# EAGLE design main (EAGLE 8.3.2)
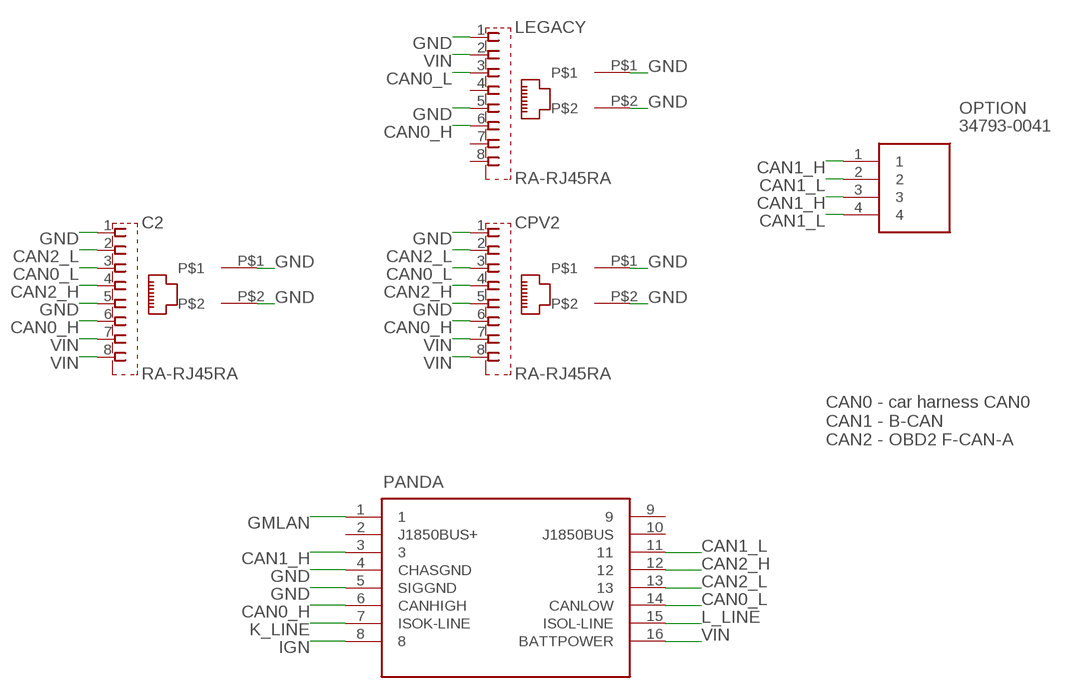
[diagram p0: schematic, sheet 1]

## Parts
C2  RA-RJ45RA  [RA-RJ45]
CPV2  RA-RJ45RA  [RA-RJ45]
LEGACY  RA-RJ45RA  [RA-RJ45]
OPTION  34793-0041  [347930041]
PANDA  OBDII-FEMALEFEMALE  [OBDII-FEMALE]

## Nets
CAN0_H: C2.6 CPV2.6 LEGACY.6 PANDA.6(CANHIGH)
CAN0_L: C2.3 CPV2.3 LEGACY.3 PANDA.14(CANLOW)
CAN1_H: OPTION.1 OPTION.3 PANDA.3
CAN1_L: OPTION.2 OPTION.4 PANDA.11
CAN2_H: C2.4 CPV2.4 PANDA.12
CAN2_L: C2.2 CPV2.2 PANDA.13
GMLAN: PANDA.1
GND [PWR]: C2.1 C2.5 C2.P$1 C2.P$2 CPV2.1 CPV2.5 CPV2.P$1 CPV2.P$2 LEGACY.1 LEGACY.5 LEGACY.P$1 LEGACY.P$2 PANDA.4(CHASGND) PANDA.5(SIGGND)
IGN [PWR]: PANDA.8
K_LINE: PANDA.7(ISOK-LINE)
L_LINE: PANDA.15(ISOL-LINE)
VIN [PWR]: C2.7 C2.8 CPV2.7 CPV2.8 LEGACY.2 PANDA.16(BATTPOWER)
Unconnected: LEGACY.4 LEGACY.7 LEGACY.8 PANDA.2(J1850BUS+) PANDA.9 PANDA.10(J1850BUS)

## Notes on the sheet
- CAN0 - car harness CAN0
  CAN1 - B-CAN
  CAN2 - OBD2 F-CAN-A

## Library data of the parts
C2 CPV2 LEGACY = comma.ai:RA-RJ45
OPTION = 34793-0041:34793-0041: Automotive Connectors 4P 1R MINI50 HEADER R/A UNSEALED GRAY Source: Datasheet <https://componentsearchengine.com/Datasheets/1/34793-0041.pdf>; DESCRIPTION: Automotive Connectors 4P 1R MINI50 HEADER R/A UNSEALED GRAY; HEIGHT: 10.02mm; MANUFACTURER_NAME: Molex; MANUFACTURER_PART_NUMBER: 34793-0041; MOUSER_PART_NUMBER: 538-34793-0041; MOUSER_PRICE-STOCK: https://www.mouser.co.uk/ProductDetail/Molex/34793-0041?qs=rBzrYveeBvH%2F3SY9c%252B8C6w%3D%3D
PANDA = comma.ai:OBDII-FEMALE

## Net classes
0 default: width 0.305 mm
1 PWR: width 0.813 mm, clearance 0.254 mm

## Board
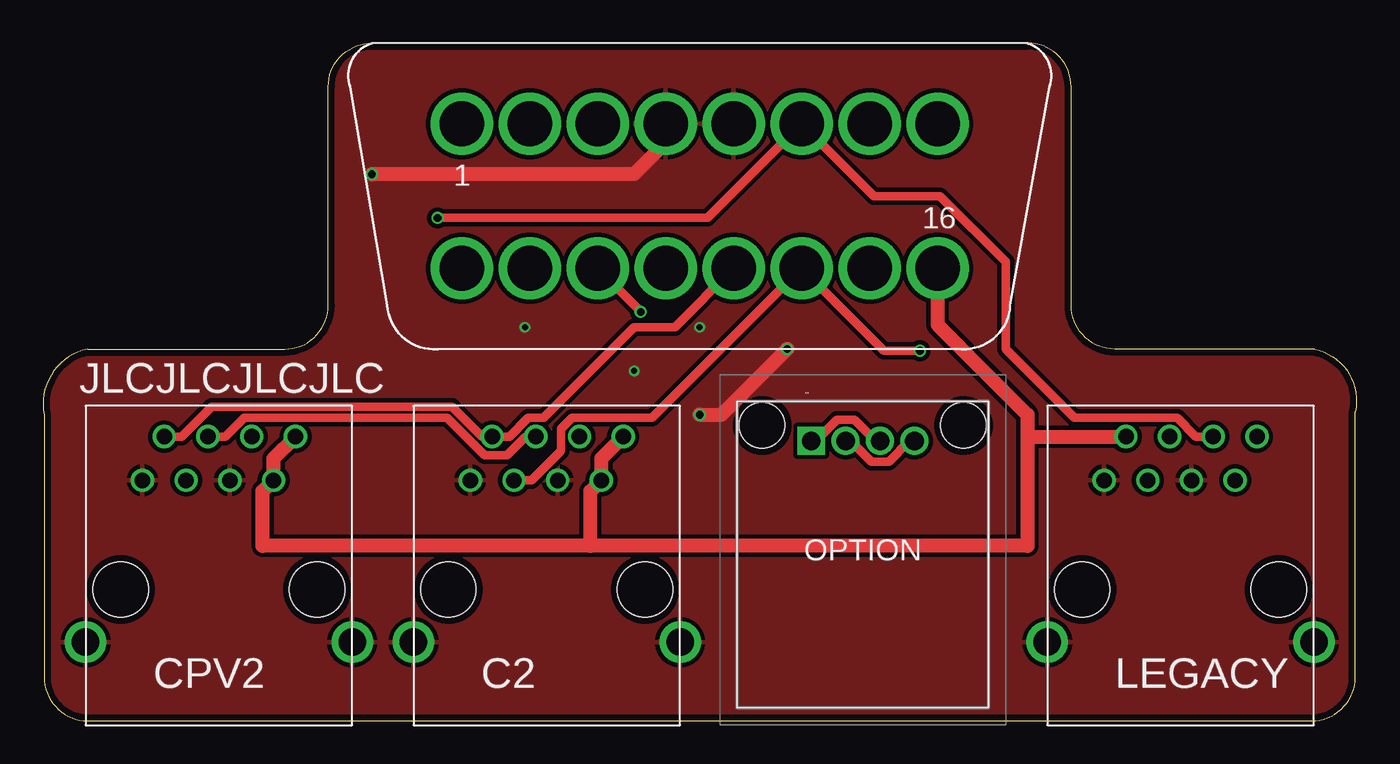
[diagram p1: board, top side]
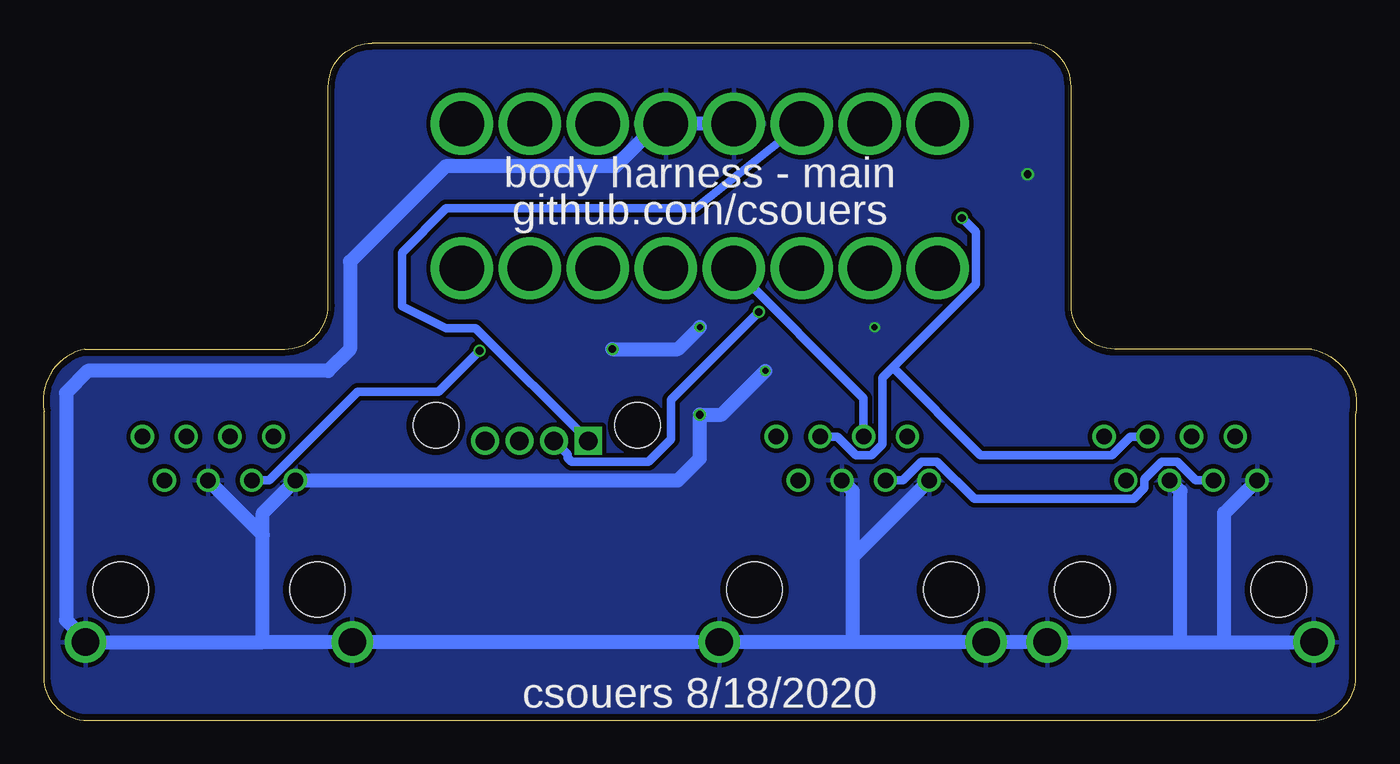
[diagram p2: board, bottom side, seen from below]

Size 76.33 x 39.37 mm. Coordinates in mm from the lower left corner, seen from the top.
Outline: 2.6,0 73.72,0 arc90 76.26,2.54 76.26,17.95 arc90 73.9,21.59 62.29,21.59 arc-90 59.75,24.13 59.75,36.83 arc90 57.21,39.37 19.11,39.37 arc90 16.57,36.83 16.57,24.13 arc-90 14.03,21.59 2.6,21.59 arc90 0.06,17.78 0.06,2.54 arc90 2.6,0
Copper layers (1*16): Top 0.035559375mm / dielectric 1.6mm / Bottom 0.035559375mm
Design rules "oshpark-2layer": minimum track width 6mil, minimum drill 10mil, track to track 6mil, track to pad 6mil, pad to pad 6mil, via to via 6mil, smd to smd 6mil, copper to edge 15mil, drill to drill 6mil, minimum pad ring 5mil, minimum via ring 5mil, stop-mask expansion 2.5mil, vias tented up to drill 0mil, thermal gap 10mil

### Footprints (pad centres in the part's own frame; a part is rotated, then mirrored left to right if it is on the bottom)
RA-RJ45 = drill 0.9: 1 -4.445,6.35; 2 -3.175,8.89; 3 -1.905,6.35; 4 -0.635,8.89; 5 0.635,6.35; 6 1.905,8.89; 7 3.175,6.35; 8 4.445,8.89 | drill 1.6: P$1 -7.75,-3.05; P$2 7.75,-3.05 | hole 3.2: -5.715,0; 5.715,0
347930041 = drill 1.08 pad 1.62 square: 1 0,0 | drill 1.08 pad 1.62: 2 2,0; 3 4,0; 4 6,0 | hole 2.63: -2.85,0.9; 8.85,0.9
OBDII-FEMALE = drill 2.6 pad 3.4: 1 13.825,-4.2; 2 9.875,-4.2; 3 5.925,-4.2; 4 1.975,-4.2; 5 -1.975,-4.2; 6 -5.925,-4.2; 7 -9.875,-4.2; 8 -13.825,-4.2; 9 13.825,4.2; 10 9.875,4.2; 11 5.925,4.2; 12 1.975,4.2; 13 -1.975,4.2; 14 -5.925,4.2; 15 -9.875,4.2; 16 -13.825,4.2

### Placement (x,y rotation side)
C2  29.27,7.62 0 top
CPV2  10.22,7.62 0 top
LEGACY  66.1,7.62 0 top
OPTION  44.64,16.26 0 top
PANDA  38.16,30.48 180 top

### Tracks (layer width: path | path; a pad name or v marks a point on that pad's centre or on a via)
CAN0_H  (via drill 0.45)
  Top 0.508: LEGACY.6 67,16.51 65.92,17.59 59.94,17.59 55.94,21.59 55.94,26.67 52.13,30.48 48.29,30.48 PANDA.6 38.62,29.21 v22.92,29.21
  Bottom 0.508: C2.6 30.17,16.51 29.09,15.43 28.19,15.43 27.56,16.06 27.56,19.93 26.95,20.54 | 26.95,20.54 22.12,25.36 22.12,28.41 v22.92,29.21 | CPV2.6 13.14,16.51 14.22,15.43 21.84,15.43 26.95,20.54
CAN0_L  (via drill 0.45)
  Top 0.508: C2.3 28.38,13.97 30.1,15.69 30.1,16.96 30.73,17.59 35.4,17.59 PANDA.14 48.87,21.5 v50.95,21.5
  Bottom 0.508: CPV2.3 9.33,13.97 10.41,15.05 11.31,15.05 12.32,14.04 12.32,13.52 12.95,12.89 22.22,12.89 24.38,15.05 25.28,15.05 26.36,13.97 C2.3 | v50.95,21.5 53.35,19.11 58.05,19.11 63.19,13.97 LEGACY.3
CAN1_H
  Top 0.508: OPTION.1 44.92,16.26 46.14,17.47 47.14,17.47 48.36,16.26 OPTION.3
  Bottom 0.508: PANDA.3 38.42,29.76 52.9,29.76 55.47,27.2 55.47,24.09 52.9,22.8 51.18,22.8 OPTION.1
CAN1_L  (via drill 0.45)
  Top 0.508: v34.73,23.75 34.73,23.79 PANDA.11 | OPTION.2 46.92,16.26 48.14,15.04 49.14,15.04 50.36,16.26 OPTION.4
  Bottom 0.508: OPTION.2 45.86,15.47 45.86,15.28 45.62,15.04 41.15,15.04 39.84,16.35 39.84,18.64 v34.73,23.75
CAN2_H
  Top 0.508: C2.4 28.04,16.51 26.96,15.43 25.65,15.43 23.49,17.59 11.68,17.59 10.6,16.51 CPV2.4
  Bottom 0.508: C2.4 28.64,18.73 PANDA.12
CAN2_L
  Top 0.508: PANDA.13 36.72,22.86 34.35,22.86 29.08,17.59 28.19,17.59 27.11,16.51 C2.2 25.5,16.51 23.76,18.25 9.8,18.25 8.06,16.51 CPV2.2
GND  (via drill 0.35, 0.45)
  Top 0.813: PANDA.4 36.19,33.59 34.35,31.75 v19.11,31.75 | v38.16,17.78 39.43,17.78 v43.24,21.59
  Bottom 0.813: 10.22,4.57 CPV2.P$2 C2.P$1 29.27,4.57 | 10.22,4.57 7.68,4.57 | 7.68,4.57 CPV2.P$1 | 29.27,4.57 C2.P$2 LEGACY.P$1 63.56,4.57 | 73.72,4.57 63.56,4.57 | 73.72,4.57 LEGACY.P$2 | 29.27,9.53 29.27,13.34 C2.5 | 29.27,4.57 29.27,9.53 | 29.27,9.53 C2.1 | 7.68,4.57 7.68,12.07 CPV2.1 | 10.22,4.57 10.22,13.34 CPV2.5 | 63.56,10.8 63.56,12.07 LEGACY.1 39.43,13.97 38.16,15.24 v38.16,17.78 36.89,17.78 v34.35,20.32 | 63.56,4.57 63.56,10.8 | 63.56,10.8 LEGACY.5 | PANDA.4 PANDA.5 40.6,34.68 43.07,32.21 52.94,32.21 58.48,26.67 58.48,21.59 59.75,20.32 73.72,20.32 74.99,19.05 74.99,5.84 73.72,4.57 | v43.24,21.59 39.43,21.59 v38.16,22.86
  other vias: 28,22.86
  pour Bottom: -1.21,-2.54 -1.21,44.45 80.07,44.45 80.07,-2.54
  pour Top: -1.21,-2.54 -1.21,44.45 80.07,44.45 80.07,-2.54
VIN
  Top 0.813: PANDA.16 51.99,23 57.21,17.78 57.21,16.51 | 57.21,16.51 57.21,10.16 31.81,10.16 | 31.81,10.16 12.76,10.16 12.76,13.34 CPV2.7 13.4,15.24 CPV2.8 | 31.81,10.16 31.81,13.34 C2.7 32.45,15.24 C2.8 | 57.21,16.51 LEGACY.2

### Text on the board
tPlace: JLCJLCJLCJLC
bPlace: body harness - main | github.com/csouers | csouers 8/18/2020